# Altium project CTR-Controller-Rev-A.PrjPcb (part 1 of 3)
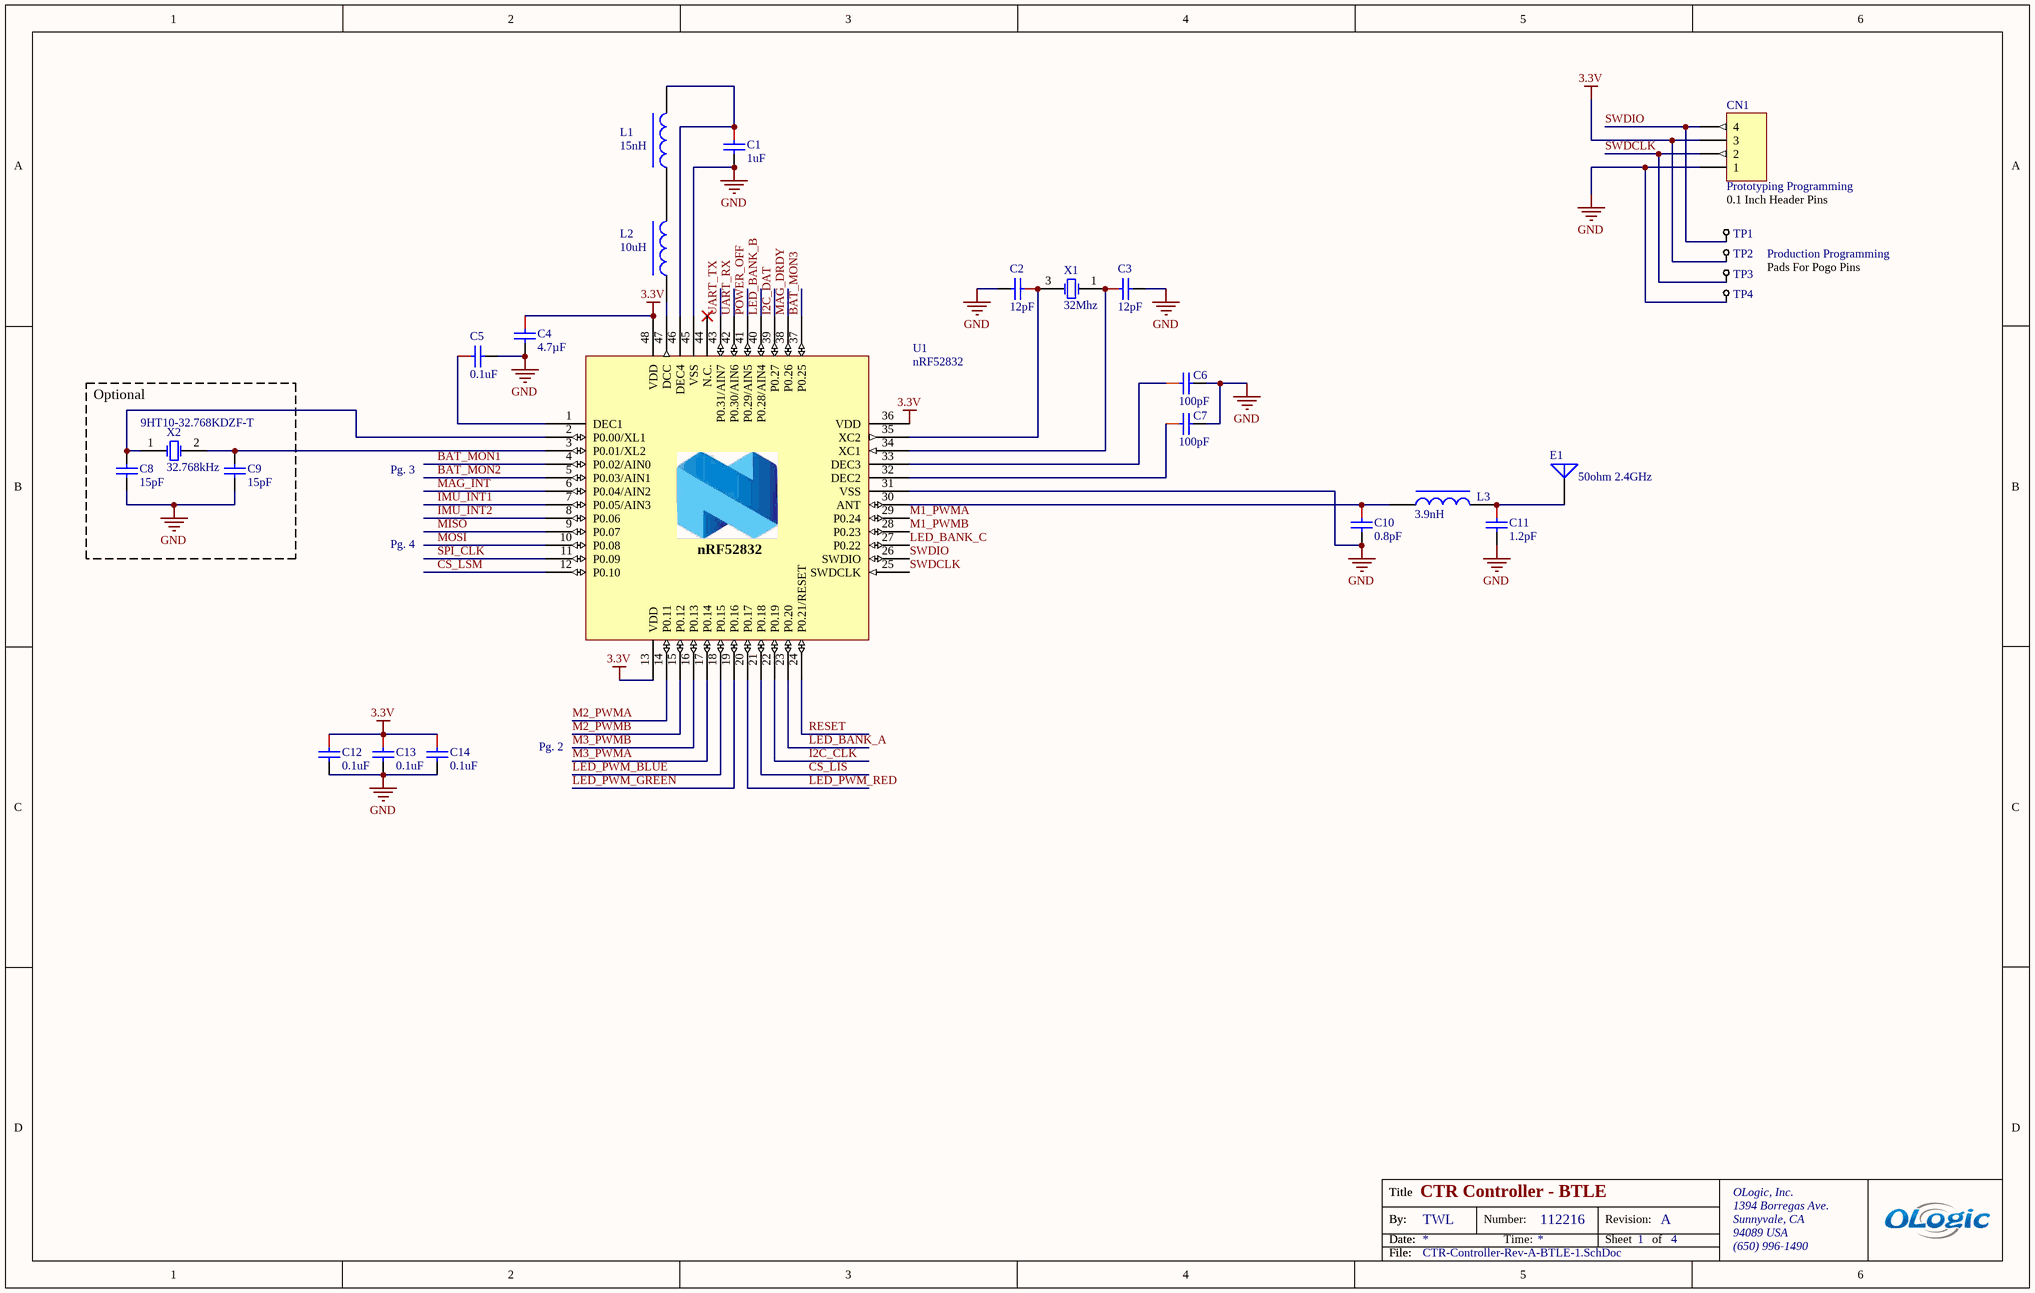
[diagram p0: CTR-Controller-Rev-A-BTLE-1.SchDoc]
5 sheets, 177 parts. Net scope: global (net labels, ports and power ports of the same name join across sheets).
Board file: CTR-Controller-Rev-A.PcbDoc
Sheets:
  CTR-Controller-Rev-A-BTLE-1.SchDoc
  CTR-Controller-Rev-A-Motor-2.SchDoc
  CTR-Controller-Rev-A-Power-3.SchDoc
  CTR-Controller-Rev-A-Sensors-4.SchDoc
  CTR-Controller-Rev-A-LED-5.SchDoc

## Sheet CTR-Controller-Rev-A-BTLE-1.SchDoc: CTR Controller - BTLE
size B; Author: TWL; Organization: OLogic, Inc.; DocumentNumber: 112216; Revision: A; SheetNumber: 1; SheetTotal: 4; PageSetup: Record=PageOptions|CenterHorizontal=True|CenterVertical=True|PrintScale=0.70|XCorrection=1.00|YCorrection=1.00|PrintKind=0|BorderSize=5000000|LeftOffset=0|BottomOffset=0|Orientation=2|PaperLength=1000|PaperWidth=1000|Scale=100|PaperSource=15|PrintQuality=600|MediaType=1|DitherType=10|PrintScaleMode=1|PaperKind=Letter|PaperIndex=1

### Parts
C1  1uF  [CAPC0402(1005)_N]
C2  12pF  [CAPC0402(1005)_N]
C3  12pF  [CAPC0402(1005)_N]
C4  Capacitance: 4.7µF  [CAPC0603(1608)_L]  (hidden comment: 4.7UF 0603)
C5  0.1uF  [CAPC0402(1005)_N]
C6  100pF  [CAPC0402(1005)_N]
C7  100pF  [CAPC0402(1005)_N]
C8  15pF  [CAPC0402(1005)_N]
C9  15pF  [CAPC0402(1005)_N]
C10  0.8pF  [CAPC0402(1005)_N]
C11  1.2pF  [CAPC0402(1005)_N]
C12  0.1uF  [CAPC0402(1005)_N]
C13  0.1uF  [CAPC0402(1005)_N]
C14  0.1uF  [CAPC0402(1005)_N]
CN1  Prototyping Programming  [HDR1X4]
E1  50ohm 2.4GHz  [ANT-Trace-nRF51822]
L1  15nH  [IND-0402]
L2  10uH  [IND-0603]
L3  3.9nH  [IND-0402]
TP1  Test Point  [TestPoint-SM]  (value not drawn)
TP2  Test Point  [TestPoint-SM]  (value not drawn)
TP3  Test Point  [TestPoint-SM]  (value not drawn)
TP4  Test Point  [TestPoint-SM]  (value not drawn)
U1  nRF52832  [QFN40P600X600X90-48N]
X1  32Mhz  [SMXOSC/2X1.6]
X2  32.768kHz  Manufacturer Part Number: 9HT10-32.768KDZF-T  [FC-135]

### Blocks framed on the sheet
Optional: C8 C9 X2

### Nets
3.3V: C4.1 C12.1 C13.1 C14.1 CN1.3 TP2.1 U1.13(VDD) U1.36(VDD) U1.48(VDD)
GND: C1.2 C2.2 C3.2 C4.2 C5.2 C6.2 C7.2 C8.1 C9.1 C10.2 C11.2 C12.2 C13.2 C14.2 CN1.1 TP4.1 U1.31(VSS) U1.45(VSS) U1.49(GND) X1.2(NC) X1.4(NC)
BAT_MON1: U1.4(P0.02/AIN0)
BAT_MON2: U1.5(P0.03/AIN1)
BAT_MON3: U1.37(P0.25)
CS_LIS: U1.21(P0.18)
CS_LSM: U1.12(P0.10)
I2C_CLK: U1.22(P0.19)
I2C_DAT: U1.39(P0.27)
IMU_INT1: U1.7(P0.05/AIN3)
IMU_INT2: U1.8(P0.06)
LED_BANK_A: U1.23(P0.20)
LED_BANK_B: U1.40(P0.28/AIN4)
LED_BANK_C: U1.27(P0.22)
LED_PWM_BLUE: U1.18(P0.15)
LED_PWM_GREEN: U1.19(P0.16)
LED_PWM_RED: U1.20(P0.17)
M1_PWMA: U1.29(P0.24)
M1_PWMB: U1.28(P0.23)
M2_PWMA: U1.14(P0.11)
M2_PWMB: U1.15(P0.12)
M3_PWMA: U1.17(P0.14)
M3_PWMB: U1.16(P0.13)
MAG_DRDY: U1.38(P0.26)
MAG_INT: U1.6(P0.04/AIN2)
MISO: U1.9(P0.07)
MOSI: U1.10(P0.08)
POWER_OFF: U1.41(P0.29/AIN5)
RESET: U1.24(P0.21/RESET)
SPI_CLK: U1.11(P0.09)
SWDCLK: CN1.2 TP3.1 U1.25(SWDCLK)
SWDIO: CN1.4 TP1.1 U1.26(SWDIO)
UART_RX: U1.42(P0.30/AIN6)
UART_TX: U1.43(P0.31/AIN7)
NetC1_1: C1.1 L1.2 U1.46(DEC4)
NetC2_1: C2.1 U1.35(XC2) X1.3(OSC2)
NetC3_1: C3.1 U1.34(XC1) X1.1(OSC1)
NetC5_1: C5.1 U1.1(DEC1)
NetC6_1: C6.1 U1.33(DEC3)
NetC7_1: C7.1 U1.32(DEC2)
NetC8_2: C8.2 U1.2(P0.00/XL1) X2.1(OSC1)
NetC9_2: C9.2 U1.3(P0.01/XL2) X2.2(OSC2)
NetC10_1: C10.1 L3.1 U1.30(ANT)
NetC11_1: C11.1 E1.1(A) L3.2
NetL1_1: L1.1 L2.2
NetL2_1: L2.1 U1.47(DCC)

Not connected (* = marked no-connect by the designer): U1 44(N.C.)*

### Notes on the sheet
- 0.1 Inch Header Pins
- Pads For Pogo Pins
- Production Programming
- Pg. 3
- Pg. 4
- Pg. 2
- Title
- By:
- Date:
- Number:
- Time:
- Revision:
- Sheet
- of
- OLogic, Inc.
- 1394 Borregas Ave.
- Sunnyvale, CA
- 94089 USA
- File:
- (650) 996-1490

### Library data of the parts
C1 = CAP CER 1UF 16V 10% X5R 0402: 1UF 0402; Manufacturer: TDK Corporation; Manufacturer Part Number: C1005X5R1C105K050BC; Capacitance: 1.0µF; Tolerance: ±10%; Voltage - Rated: 16V; Temperature Coefficient: X5R; ClassName: CPU; Supplier 1: Digi-Key; RoHS: RoHS Compliant; Category: Capacitors; Stock 1: 490204; Pricing 1: 1=0.12, 10=0.08, 100=0.038, 250=0.032, 500=0.0268, 1000=0.022, 5000=0.0186 (USD); Packaging: Cut Tape (CT); Mounting Type: Surface Mount, MLCC; Operating Temperature: -55°C ~ 85°C; Applications: General Purpose; Ratings: -; Package / Case: 0402 (1005 Metric); Size / Dimension: 0.039" L x 0.020" W (1.00mm x 0.50mm); Height - Seated (Max): -; Thickness (Max): 0.022" (0.55mm); Lead Spacing: -; Features: -; Lead Style: -; ComponentLink1URL: http://product.tdk.com/en/catalog/datasheets/mlcc_commercial_general_en.pdf; ComponentLink1Description: http://product.tdk.com/en/catalog/datasheets/mlcc_commercial_general_en.pdf; Supplier Part Number 1: 445-4978-1-ND
C2 C3 = CAP CER 12PF 50V 5% NP0 0402: 12pF 0402; Manufacturer: Samsung Electro-Mechanics America, Inc; Manufacturer Part Number: CL05C120JB5NNNC; Tolerance: ±5%; Voltage - Rated: 50V; Temperature Coefficient: C0G, NP0; ClassName: CPU; Supplier 1: Digi-Key; RoHS: RoHS Compliant; Category: Capacitors; Stock 1: 132387; Pricing 1: 1=0.1, 10=0.013, 25=0.0092, 100=0.0061, 500=0.00424, 1000=0.0033, 2500=0.00297, 5000=0.00275 (USD); Packaging: Cut Tape (CT); Capacitance: 12pF; Mounting Type: Surface Mount, MLCC; Operating Temperature: -55°C ~ 125°C; Applications: General Purpose; Ratings: -; Package / Case: 0402 (1005 Metric); Size / Dimension: 0.039" L x 0.020" W (1.00mm x 0.50mm); Height - Seated (Max): -; Thickness (Max): 0.022" (0.55mm); Lead Spacing: -; Features: -; Lead Style: -; ComponentLink1URL: http://www.samsungsem.com/kr/front/downloadcms.do?path=/kr/support/product-search/mlcc/__icsFiles/afieldfile/2015/04/15&fileName=CL05C120JB5NNNC.pdf; ComponentLink1Description: http://www.samsungsem.com/kr/front/downloadcms.do?path=/kr/support/product-search/mlcc/__icsFiles/afieldfile/2015/04/15&fileName=CL05C120JB5NNNC.pdf; Supplier Part Number 1: 1276-1178-1-ND
C4 = CAP CER 4.7UF 16V 10% X5R 0603: Manufacturer: Taiyo Yuden; Manufacturer Part Number: EMK107ABJ475KA-T; Tolerance: ±10%; Voltage - Rated: 16V; Temperature Coefficient: X5R; ClassName: CPU; Supplier 1: Digi-Key; RoHS: RoHS Compliant; Category: Capacitors; Stock 1: 498907; Pricing 1: 1=0.26, 10=0.216, 50=0.1216, 100=0.108, 250=0.081, 500=0.07154, 1000=0.06345 (USD); Packaging: Cut Tape (CT); Mounting Type: Surface Mount, MLCC; Operating Temperature: -55°C ~ 85°C; Applications: General Purpose; Ratings: -; Package / Case: 0603 (1608 Metric); Size / Dimension: 0.063" L x 0.031" W (1.60mm x 0.80mm); Height - Seated (Max): -; Thickness (Max): 0.035" (0.90mm); Lead Spacing: -; Features: -; Lead Style: -; ComponentLink1URL: http://www.yuden.co.jp/or/product/category/capacitor/EMK107ABJ475KA-T.pdf; ComponentLink1Description: http://www.yuden.co.jp/or/product/category/capacitor/EMK107ABJ475KA-T.pdf; Supplier Part Number 1: 587-2786-1-ND; Creator: osman
C5 C12-C14 = CAP CER 0.1UF 50V 10% X7R 0402: 0.1uF 0402 50V; Manufacturer: TDK Corporation; Manufacturer Part Number: CGA2B3X7R1H104K050BB; Capacitance: 0.1µF; Tolerance: ±10%; Temperature Coefficient: X7R; Supplier 1: Digi-Key; RoHS: RoHS Compliant; Category: Capacitors; Stock 1: 1584397; Pricing 1: 1=0.16, 10=0.11, 100=0.0523, 250=0.044, 500=0.03686, 1000=0.03025, 5000=0.02558 (USD); Packaging: Cut Tape (CT); Voltage - Rated: 50V; Mounting Type: Surface Mount, MLCC; Operating Temperature: -55°C ~ 125°C; Applications: Automotive; Ratings: AEC-Q200; Package / Case: 0402 (1005 Metric); Size / Dimension: 0.039" L x 0.020" W (1.00mm x 0.50mm); Height - Seated (Max): -; Thickness (Max): 0.022" (0.55mm); Lead Spacing: -; Features: -; Lead Style: -; ComponentLink1URL: http://product.tdk.com/en/catalog/datasheets/mlcc_automotive_general_en.pdf; ComponentLink1Description: http://product.tdk.com/en/catalog/datasheets/mlcc_automotive_general_en.pdf; Supplier Part Number 1: 445-6899-1-ND; Creator: osman; ClassName: CPU
C6 C7 = CAP CER 100PF 50V 5% NP0 0402: 100pF 0402 50V; Manufacturer: Murata Electronics North America; Manufacturer Part Number: GRM1555C1H101JA01D; Tolerance: ±5%; Temperature Coefficient: C0G, NP0; ClassName: CPU; Supplier 1: Digi-Key; RoHS: RoHS Compliant; Category: Capacitors; Stock 1: 1246257; Pricing 1: 1=0.1, 10=0.013, 50=0.007, 100=0.0059, 250=0.00488, 500=0.00416, 1000=0.00324, 5000=0.0027 (USD); Packaging: Cut Tape (CT); Capacitance: 100pF; Voltage - Rated: 50V; Mounting Type: Surface Mount, MLCC; Operating Temperature: -55°C ~ 125°C; Applications: General Purpose; Ratings: -; Package / Case: 0402 (1005 Metric); Size / Dimension: 0.039" L x 0.020" W (1.00mm x 0.50mm); Height - Seated (Max): -; Thickness (Max): 0.022" (0.55mm); Lead Spacing: -; Features: -; Lead Style: -; ComponentLink1URL: http://www.murata.com/~/media/webrenewal/support/library/catalog/products/capacitor/mlcc/c02e.ashx; ComponentLink1Description: http://www.murata.com/~/media/webrenewal/support/library/catalog/products/capacitor/mlcc/c02e.ashx; Supplier Part Number 1: 490-5922-1-ND
C8 = Capacitor: Manufacturer: Murata Electronics North America; Manufacturer Part Number: GRM1555C1H150JA01D; PN: 490-5888-1-ND; Vendor: Digikey; Tolerance: ±5%; Voltage - Rated: 50V; Temperature Coefficient: C0G, NP0; ClassName: CPU; Supplier 1: Digi-Key; Supplier Part Number 1: 490-5888-1-ND; RoHS: RoHS Compliant; Category: Capacitors; Stock 1: 332846; Pricing 1: 1=0.1, 10=0.013, 50=0.007, 100=0.0059, 250=0.0048, 500=0.00412, 1000=0.00315, 5000=0.00263 (USD); Packaging: Cut Tape (CT); Capacitance: 15pF; Mounting Type: Surface Mount, MLCC; Operating Temperature: -55°C ~ 125°C; Applications: General Purpose; Ratings: -; Package / Case: 0402 (1005 Metric); Size / Dimension: 0.039" L x 0.020" W (1.00mm x 0.50mm); Height - Seated (Max): -; Thickness (Max): 0.022" (0.55mm); Lead Spacing: -; Features: -; Lead Style: -; ComponentLink1URL: http://www.murata.com/~/media/webrenewal/support/library/catalog/products/capacitor/mlcc/c02e.ashx; ComponentLink1Description: http://www.murata.com/~/media/webrenewal/support/library/catalog/products/capacitor/mlcc/c02e.ashx
C9 = Capacitor: Manufacturer: TDK; MPN: C1608C0G1H150J080AA; Manufacturer Part Number: GRM1555C1H150JA01D; PN: 445-1271-1-ND; Vendor: Digikey; Tolerance: ±5%; Voltage - Rated: 50V; Temperature Coefficient: C0G, NP0; ClassName: CPU; Supplier 1: Digi-Key; Supplier Part Number 1: 490-5888-1-ND; RoHS: RoHS Compliant; Category: Capacitors; Stock 1: 332846; Pricing 1: 1=0.1, 10=0.013, 50=0.007, 100=0.0059, 250=0.0048, 500=0.00412, 1000=0.00315, 5000=0.00263 (USD); Packaging: Cut Tape (CT); Capacitance: 15pF; Mounting Type: Surface Mount, MLCC; Operating Temperature: -55°C ~ 125°C; Applications: General Purpose; Ratings: -; Package / Case: 0402 (1005 Metric); Size / Dimension: 0.039" L x 0.020" W (1.00mm x 0.50mm); Height - Seated (Max): -; Thickness (Max): 0.022" (0.55mm); Lead Spacing: -; Features: -; Lead Style: -; ComponentLink1URL: http://www.murata.com/~/media/webrenewal/support/library/catalog/products/capacitor/mlcc/c02e.ashx; ComponentLink1Description: http://www.murata.com/~/media/webrenewal/support/library/catalog/products/capacitor/mlcc/c02e.ashx
C10 = CAP CER 0.8pF 50V 0402: 0.8pF 0402; Manufacturer: Murata Electronics North America; Manufacturer Part Number: GJM1555C1HR80WB01D; Capacitance: 0.80pF; Tolerance: ±0.05pF; Voltage - Rated: 50V; Temperature Coefficient: C0G, NP0; Supplier 1: Digi-Key; RoHS: RoHS Compliant; Category: Capacitors; Stock 1: 18923; Pricing 1: 1=0.26, 10=0.216, 50=0.1216, 100=0.108, 250=0.081, 500=0.07156, 1000=0.06345, 5000=0.05265 (USD); Packaging: Cut Tape (CT); Part Status: Active; Operating Temperature: -55°C ~ 125°C; Features: High Q, Low Loss; Ratings: -; Applications: RF, Microwave, High Frequency; Failure Rate: *; Mounting Type: Surface Mount, MLCC; Package / Case: 0402 (1005 Metric); Size / Dimension: 0.039" L x 0.020" W (1.00mm x 0.50mm); Height - Seated (Max): -; Thickness (Max): 0.022" (0.55mm); Lead Spacing: -; Lead Style: -; ComponentLink1URL: http://www.murata.com/~/media/webrenewal/support/library/catalog/products/capacitor/mlcc/c02e.pdf; ComponentLink1Description: http://www.murata.com/~/media/webrenewal/support/library/catalog/products/capacitor/mlcc/c02e.pdf; Supplier Part Number 1: 490-11253-1-ND; ClassName: CPU
C11 = CAP CER 1.2PF 50V NP0 0402: 1.2pF 0402; Manufacturer: Murata Electronics North America; Manufacturer Part Number: GRM1555C1H1R2CA01D; Tolerance: ±0.25pF; Voltage - Rated: 50V; Temperature Coefficient: C0G, NP0; ClassName: CPU; Supplier 1: Digi-Key; RoHS: RoHS Compliant; Category: Capacitors; Stock 1: 91522; Pricing 1: 1=0.1, 10=0.028, 50=0.015, 100=0.0127, 250=0.01036, 500=0.00886, 1000=0.0069, 5000=0.00575 (USD); Packaging: Cut Tape (CT); Capacitance: 1.2pF; Mounting Type: Surface Mount, MLCC; Operating Temperature: -55°C ~ 125°C; Applications: General Purpose; Ratings: -; Package / Case: 0402 (1005 Metric); Size / Dimension: 0.039" L x 0.020" W (1.00mm x 0.50mm); Height - Seated (Max): -; Thickness (Max): 0.022" (0.55mm); Lead Spacing: -; Features: -; Lead Style: -; ComponentLink1URL: http://www.murata.com/~/media/webrenewal/support/library/catalog/products/capacitor/mlcc/c02e.ashx; ComponentLink1Description: http://www.murata.com/~/media/webrenewal/support/library/catalog/products/capacitor/mlcc/c02e.ashx; Supplier Part Number 1: 490-5927-1-ND
CN1 = Header 4: Header, 4-Pin; Manufacturer: TE Connectivity / AMP; Manufacturer Part Number: 826936-4; Mounting Angle: Vertical; Number of Positions: 4; Pitch: 2.54 mm; Mating Post Length: 5.8 mm; Supplier 1: Mouser; RoHS: RoHS Compliant; Category: Headers & Wire Housings; Stock 1: 1715; Pricing 1: 1=0.250, 25=0.239, 50=0.233, 100=0.216, 250=0.206, 500=0.178, 1000=0.160, 2000=0.154, 5000=0.146 (USD); Contact Plating: Tin; Housing Material: Thermoplastic; Number of Rows: 1; Series: AMPMODU MOD II; Termination Style: Through Hole; Type: Breakaway; Brand: TE Connectivity / AMP; Contact Material: Brass; Flammability Rating: UL 94 V-0; Mounting Style: -; Row Spacing: 2.54 mm; Contact Gender: Pin (Male); Product Category: AMPMODU Breakaway Headers; Product Type: Headers; Standard Pack Qty: 1500; Termination Post Length: 3.2 mm; Tradename: AMPMODU; RoHS - Mouser: Y; Minimum Order Quantity: 1; Reeling: False; ComponentLink1URL: http://www.te.com/catalog/pn/en/826936-4; ComponentLink1Description: http://www.te.com/catalog/pn/en/826936-4; Supplier Part Number 1: 571-826936-4; ClassName: PROG
E1 = Antenna2.4GHz: 2.4GHz Trace Antenna; ClassName: CPU
L1 = INDUCTOR 15nH 0402 SMD: 15nH 0402; Manufacturer: Taiyo Yuden; Manufacturer Part Number: HK100515NJ-T; Type: Multilayer; Material - Core: Ferrite; Tolerance: ±5%; Current Rating: 320mA; Shielding: Unshielded; DC Resistance (DCR): 460 mOhm Max; Q @ Freq: 8 @ 100MHz; Frequency - Self Resonant: 2.3GHz; Frequency - Test: 100MHz; Supplier 1: Digi-Key; RoHS: RoHS Compliant; Category: Inductors, Coils, Chokes; Stock 1: 130590; Pricing 1: 1=0.1, 10=0.06, 25=0.054, 50=0.0468, 100=0.042, 250=0.039, 500=0.036, 1000=0.0312 (USD); Packaging: Cut Tape (CT); Part Status: Active; Inductance: 15nH; Current - Saturation: -; Ratings: -; Operating Temperature: -55°C ~ 125°C; Mounting Type: Surface Mount; Package / Case: 0402 (1005 Metric); Size / Dimension: 0.039" L x 0.020" W (1.00mm x 0.50mm); Height - Seated (Max): 0.022" (0.55mm); ComponentLink1URL: http://ds.yuden.co.jp/TYCOMPAS/ut/detail.do?productNo=HK100515NJ-T&fileName=HK100515NJ-T_SS&mode=specSheetDownload; ComponentLink1Description: http://ds.yuden.co.jp/TYCOMPAS/ut/detail.do?productNo=HK100515NJ-T&fileName=HK100515NJ-T_SS&mode=specSheetDownload; Supplier Part Number 1: 587-1521-1-ND; ClassName: CPU
L2 = INDUCTOR 10UH 5% 0603 SMD: 10uH 0603; Manufacturer: Taiyo Yuden; Manufacturer Part Number: LBMF1608T100K; Type: Wirewound; Inductance: 10µH; Tolerance: ±10%; Current Rating: 80mA; Shielding: Unshielded; DC Resistance (DCR): 360 mOhm; Frequency - Self Resonant: 32MHz; Frequency - Test: 2.52MHz; Supplier 1: Digi-Key; RoHS: RoHS Compliant; Category: Inductors, Coils, Chokes; Stock 1: 49989; Pricing 1: 1=0.25, 10=0.225, 25=0.2024, 50=0.1756, 100=0.1575, 250=0.14624, 500=0.135, 1000=0.117 (USD); Packaging: Cut Tape (CT); Part Status: Active; Material - Core: -; Current - Saturation: -; Q @ Freq: -; Ratings: -; Operating Temperature: -40°C ~ 105°C; Mounting Type: Surface Mount; Package / Case: 0603 (1608 Metric); Size / Dimension: 0.063" L x 0.031" W (1.60mm x 0.80mm); Height - Seated (Max): 0.039" (1.00mm); ComponentLink1URL: http://ds.yuden.co.jp/TYCOMPAS/ut/detail.do?productNo=LBMF1608T100K&fileName=LBMF1608T100K_SS&mode=specSheetDownload; ComponentLink1Description: http://ds.yuden.co.jp/TYCOMPAS/ut/detail.do?productNo=LBMF1608T100K&fileName=LBMF1608T100K_SS&mode=specSheetDownload; Supplier Part Number 1: 587-1714-1-ND; ClassName: CPU
L3 = INDUCTOR 3.9nH 0402 SMD: 3.9nH 0402; Manufacturer: Murata Electronics North America; Manufacturer Part Number: LQP15MN3N9B02D; Type: Thin Film; Material - Core: Non-Magnetic; Tolerance: ±0.1nH; Current Rating: 170mA; Shielding: Unshielded; DC Resistance (DCR): 500 mOhm Max; Q @ Freq: 13 @ 500MHz; Frequency - Self Resonant: 6GHz; Frequency - Test: 500MHz; Supplier 1: Digi-Key; RoHS: RoHS Compliant; Category: Inductors, Coils, Chokes; Stock 1: 45413; Pricing 1: 1=0.18, 10=0.167, 25=0.1504, 50=0.1302, 100=0.1169, 250=0.10856, 500=0.1002, 750=0.09519, 1000=0.08684 (USD); Packaging: Cut Tape (CT); Part Status: Active; Inductance: 3.9nH; Current - Saturation: -; Ratings: -; Operating Temperature: -40°C ~ 85°C; Mounting Type: Surface Mount; Package / Case: 0402 (1005 Metric); Size / Dimension: 0.039" L x 0.020" W (1.00mm x 0.50mm); Height - Seated (Max): 0.018" (0.45mm); ComponentLink1URL: http://search.murata.co.jp/Ceramy/image/img/PDF/ENG/L0075S0084LQP15M.pdf; ComponentLink1Description: http://search.murata.co.jp/Ceramy/image/img/PDF/ENG/L0075S0084LQP15M.pdf; Supplier Part Number 1: 490-1131-1-ND; ClassName: CPU
TP1-TP4 = TestPoint, small: ClassName: PROG
U1 = nRF52832_QFAA: Multi-protocol Bluetooth Low Energy and 2.4GHz proprietary system-on-chip; Manufacturer: Nordic Semiconductor; Manufacturer Part Number: nRF52832-QFAA-T; Output Power: + 4 dBm to - 20 dBm; Program Memory Type: Flash; Sensitivity: - 96 dBm; Data RAM Size: 64 kB; Data RAM Type: RAM; Interface Type: 2-Wire, I2C, I2S, PDM, SPI, UART; Number of I/Os: 32 I/O; Program Memory Size: 512 kB; ADC Resolution: 12 bit; Core: ARM Cortex M4F; Data Bus Width: 32 bit; Maximum Clock Frequency: 32 kHz; Maximum Data Rate: 2 Mb/s; Number of ADC Channels: 8 Channel; Number of Timers: 5 x 32 bit, 3 x 24 bit; Operating Supply Voltage: 1.7 V to 3.6 V; Processor Series: nRF52; Supply Current Receiving: 5.4 mA; Supply Current Transmitting: 7.5 mA; Product Status: New Product; Supplier 1: Mouser; RoHS: RoHS Compliant; Category: RF System on a Chip - SoC; Stock 1: 700; Pricing 1: 1=5.46, 100=4.38, 500=3.99, 1000=3.60, 3000=3.21 (USD); Operating Frequency: 2.4 GHz; Operating Temperature Range: - 40 C to + 85 C; Package / Case: QFN-48; Type: Bluetooth; Brand: Nordic Semiconductor; Mounting Style: SMD/SMT; Standard Pack Qty: 1; RoHS - Mouser: Y; Minimum Order Quantity: 1; Reeling: False; ComponentLink1URL: http://www.mouser.com/ds/2/297/nRF52832 Product Brief v1.2-890472.pdf; ComponentLink1Description: http://www.mouser.com/ds/2/297/nRF52832 Product Brief v1.2-890472.pdf; Supplier Part Number 1: 949-NRF52832-QFAA-T
X1 = CRYSTAL 32.0000MHZ 8PF SMD: 32Mhz Parallel Load Crystal; Manufacturer: AVX Corp/Kyocera Corp; Manufacturer Part Number: CX2016DB32000D0FLJCC; Frequency Stability: ±15ppm; Frequency Tolerance: ±10ppm; Load Capacitance: 8pF; ESR (Equivalent Series Resistance): 60 Ohm; Operating Mode: Fundamental; ClassName: CPU; Supplier 1: Digi-Key; RoHS: RoHS Compliant; Category: Crystals, Oscillators, Resonators; Stock 1: 14855; Pricing 1: 1=0.94, 10=0.835, 50=0.7804, 100=0.6897, 500=0.6534, 1000=0.5445 (USD); Packaging: Cut Tape (CT); Part Status: Active; Type: MHz Crystal; Frequency: 32MHz; Operating Temperature: -30°C ~ 85°C; Ratings: -; Mounting Type: Surface Mount; Package / Case: 4-SMD, No Lead (DFN, LCC); Size / Dimension: 0.079" L x 0.063" W (2.00mm x 1.60mm); Height - Seated (Max): 0.018" (0.45mm); ComponentLink1URL: http://media.digikey.com/pdf/Data%20Sheets/Optrex%20PDFs/CX2016DB_Series_Spec.pdf; ComponentLink1Description: http://media.digikey.com/pdf/Data%20Sheets/Optrex%20PDFs/CX2016DB_Series_Spec.pdf; Supplier Part Number 1: 1253-1118-1-ND
X2 = CRYSTAL 32.768KHZ 12.5PF 2-SMD: 32.768kHz 12.5PF 2-SMD; Manufacturer: TXC CORPORATION; Frequency Tolerance: ±20ppm; ESR (Equivalent Series Resistance): 70 kOhm; Operating Mode: Fundamental; ClassName: *; Supplier 1: Digi-Key; RoHS: RoHS Compliant; Category: Crystals and Oscillators; Stock 1: 6355; Pricing 1: 1=0.66, 10=0.581, 50=0.5424, 100=0.48, 500=0.4536, 1000=0.3792 (USD); Packaging: Cut Tape (CT); Type: kHz Crystal (Tuning Fork); Frequency: 32.768kHz; Frequency Stability: -; Load Capacitance: 12.5pF; Operating Temperature: -40°C ~ 85°C; Ratings: -; Mounting Type: Surface Mount; Package / Case: 2-SMD; Size / Dimension: 0.126" L x 0.059" W (3.20mm x 1.50mm); Height: 0.033" (0.85mm); ComponentLink1URL: http://www.txccrystal.com/images/pdf/9ht10.pdf; ComponentLink1Description: http://www.txccrystal.com/images/pdf/9ht10.pdf; Supplier Part Number 1: 887-1504-1-ND

## Sheet CTR-Controller-Rev-A-Motor-2.SchDoc: CTR Controller - Motor
size B; Author: TWL; Organization: OLogic, Inc.; DocumentNumber: 112216; Revision: A; SheetNumber: 2; SheetTotal: 4; PageSetup: Record=PageOptions|CenterHorizontal=True|CenterVertical=True|PrintScale=0.70|XCorrection=1.00|YCorrection=1.00|PrintKind=0|BorderSize=5000000|LeftOffset=0|BottomOffset=0|Orientation=2|PaperLength=1000|PaperWidth=1000|Scale=100|PaperSource=15|PrintQuality=600|MediaType=1|DitherType=10|PrintScaleMode=1|PaperKind=Letter|PaperIndex=1
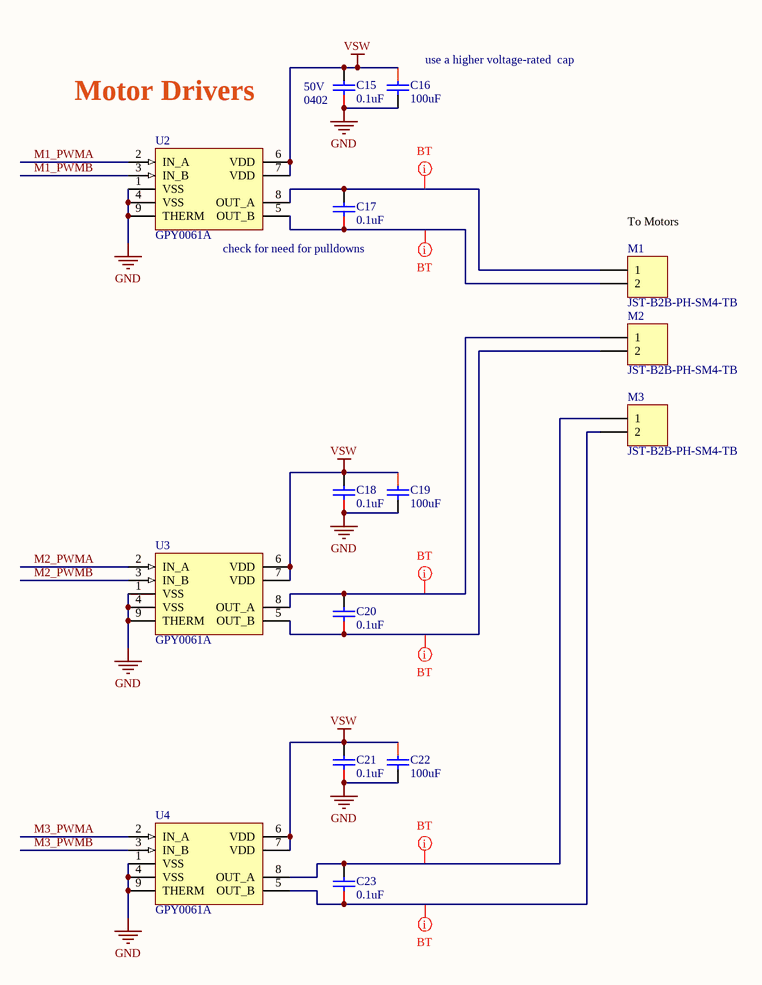
[diagram p1: CTR-Controller-Rev-A-Motor-2.SchDoc]

### Parts
C15  0.1uF  Voltage - Rated: 50V  Package / Case: 0402  [CAPC0402(1005)_N]
C16  100uF  [CAPC1206(3216)_M]
C17  0.1uF  [CAPC0402(1005)_N]
C18  0.1uF  [CAPC0402(1005)_N]
C19  100uF  [CAPC1206(3216)_M]
C20  0.1uF  [CAPC0402(1005)_N]
C21  0.1uF  [CAPC0402(1005)_N]
C22  100uF  [CAPC1206(3216)_M]
C23  0.1uF  [CAPC0402(1005)_N]
M1  JST-B2B-PH-SM4-TB  [JST-B2B-PH-SM4-TB]
M2  JST-B2B-PH-SM4-TB  [JST-B2B-PH-SM4-TB]
M3  JST-B2B-PH-SM4-TB  [JST-B2B-PH-SM4-TB]
U2  GPY0061A  [SOG.050/8C-T]
U3  GPY0061A  [SOG.050/8C-T]
U4  GPY0061A  [SOG.050/8C-T]

### Nets
GND: C15.1 C16.2 C18.1 C19.2 C21.1 C22.2 M1.0 M2.0 M3.0 U2.1(VSS) U2.4(VSS) U2.9(THERM) U3.1(VSS) U3.4(VSS) U3.9(THERM) U4.1(VSS) U4.4(VSS) U4.9(THERM)
VSW: C15.2 C16.1 C18.2 C19.1 C21.2 C22.1 U2.6(VDD) U2.7(VDD) U3.6(VDD) U3.7(VDD) U4.6(VDD) U4.7(VDD)
M1_PWMA: U2.2(IN_A)
M1_PWMB: U2.3(IN_B)
M2_PWMA: U3.2(IN_A)
M2_PWMB: U3.3(IN_B)
M3_PWMA: U4.2(IN_A)
M3_PWMB: U4.3(IN_B)
NetC17_1: C17.1 M1.2 U2.5(OUT_B)
NetC17_2: C17.2 M1.1 U2.8(OUT_A)
NetC20_1: C20.1 M2.2 U3.5(OUT_B)
NetC20_2: C20.2 M2.1 U3.8(OUT_A)
NetC23_1: C23.1 M3.2 U4.5(OUT_B)
NetC23_2: C23.2 M3.1 U4.8(OUT_A)

### Layout directives
net class BT: NetC17_1, NetC17_2, NetC20_1, NetC20_2, NetC23_1, NetC23_2

### Notes on the sheet
- (near C16) use a higher voltage-rated  cap
- Motor Drivers
- check for need for pulldowns
- (near M1) To Motors
- Title
- By:
- Date:
- Number:
- Time:
- Revision:
- Sheet
- of
- OLogic, Inc.
- 1394 Borregas Ave.
- Sunnyvale, CA
- 94089 USA
- File:
- (650) 996-1490

### Library data of the parts
C15 C17 C18 C20 C21 C23 = CAP CER 0.1UF 50V 10% X7R 0402: as C5 on sheet CTR-Controller-Rev-A-BTLE-1; Supplier 1: Digi-Key; RoHS: RoHS Compliant; Category: Capacitors; Stock 1: 1584397; Pricing 1: 1=0.16, 10=0.11, 100=0.0523, 250=0.044, 500=0.03686, 1000=0.03025, 5000=0.02558 (USD); Packaging: Cut Tape (CT); Mounting Type: Surface Mount, MLCC; Operating Temperature: -55°C ~ 125°C; Applications: Automotive; Ratings: AEC-Q200; Size / Dimension: 0.039" L x 0.020" W (1.00mm x 0.50mm); Height - Seated (Max): -; Thickness (Max): 0.022" (0.55mm); Lead Spacing: -; Features: -; Lead Style: -; ComponentLink1URL: http://product.tdk.com/en/catalog/datasheets/mlcc_automotive_general_en.pdf; ComponentLink1Description: http://product.tdk.com/en/catalog/datasheets/mlcc_automotive_general_en.pdf; Supplier Part Number 1: 445-6899-1-ND; Creator: osman
  C15: ClassName: motor1
  C17: Voltage - Rated: 50V; Package / Case: 0402 (1005 Metric); ClassName: motor1
  C18 C20: Voltage - Rated: 50V; Package / Case: 0402 (1005 Metric); ClassName: motor2
  C21 C23: Voltage - Rated: 50V; Package / Case: 0402 (1005 Metric); ClassName: motor3
C16 C19 C22 = CAP CER 100UF 6.3V 20% X5R 1206: 100uF 1206; Manufacturer: Murata Electronics North America; Manufacturer Part Number: GRM31CR60J107ME39K; Capacitance: 100µF; Tolerance: ±20%; Voltage - Rated: 6.3V; Temperature Coefficient: X5R; Supplier 1: Digi-Key; RoHS: RoHS Compliant; Category: Capacitors; Stock 1: 39934; Pricing 1: 1=0.81, 10=0.689, 50=0.507, 100=0.403, 250=0.338, 500=0.3055, 1000=0.2795 (USD); Packaging: Cut Tape (CT); Mounting Type: Surface Mount, MLCC; Operating Temperature: -55°C ~ 85°C; Applications: General Purpose; Ratings: -; Package / Case: 1206 (3216 Metric); Size / Dimension: 0.126" L x 0.063" W (3.20mm x 1.60mm); Height - Seated (Max): -; Thickness (Max): 0.071" (1.80mm); Lead Spacing: -; Features: -; Lead Style: -; ComponentLink1URL: http://www.murata.com/~/media/webrenewal/support/library/catalog/products/capacitor/mlcc/c02e.ashx; ComponentLink1Description: http://www.murata.com/~/media/webrenewal/support/library/catalog/products/capacitor/mlcc/c02e.ashx; Supplier Part Number 1: 490-7217-1-ND
  C16: ClassName: motor1
  C19: ClassName: motor2
  C22: ClassName: motor3
M1-M3 = JST-B2B-PH-SM4-TB: 2mm Locking Header, 2-Pin; Manufacturer: JST; MPN: B2B-PH-SM4-TB(LF)(SN); Vendor: Digikey; PN: 455-1734-1-ND; Connector Type: Header, Shrouded; Number of Positions: 2; Number of Positions Loaded: All; Pitch: 0.079" (2.00mm); Supplier 1: Digi-Key; Manufacturer Part Number: B2B-PH-SM4-TB(LF)(SN); RoHS: RoHS Compliant; Category: Connectors, Interconnects; Stock 1: 43142; Pricing 1: 1=0.51, 10=0.478, 50=0.3824, 100=0.3664, 250=0.33456, 500=0.31862 (USD); Packaging: Cut Tape (CT); Contact Type: Male Pin; Number of Rows: 1; Row Spacing: -; Contact Mating Length: -; Mounting Type: Surface Mount; Termination: Solder; Fastening Type: -; Features: Solder Retention; Contact Finish: Tin; Contact Finish Thickness: -; Color: Natural; ComponentLink1URL: http://www.jst-mfg.com/product/pdf/eng/ePH.pdf; ComponentLink1Description: http://www.jst-mfg.com/product/pdf/eng/ePH.pdf; Supplier Part Number 1: 455-1734-1-ND
U2 = GPY0061A: 2A Motor Driver; Manufacturer: GeneralPlus; Supplier 1: Spectrum Rep.; Manufacturer Part Number: GPY0061A; Supplier Part Number 1: GPY0061A; ClassName: motor1
U3 U4 = GPY0061A: 2A Motor Driver; Manufacturer: GeneralPlus; Vendor: Spectrum Rep.; MPN: GPY0061A; PN: GPY0061A; Manufacturer Part Number: GPY0061A; Supplier 1: Spectrum Rep.; Supplier Part Number 1: GPY0061A
  U3: ClassName: motor2
  U4: ClassName: motor3